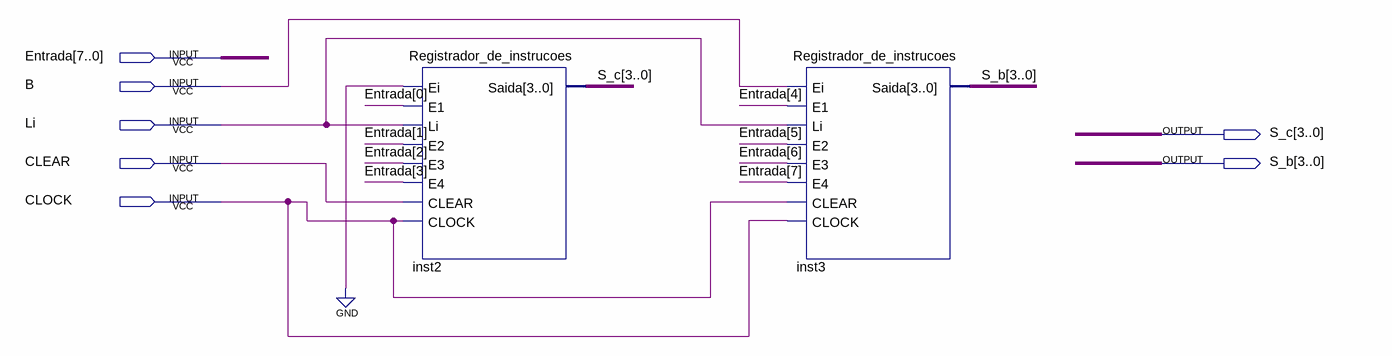
[diagram p0: schematic sheet]
// Quartus schematic Registrador_de_instrucoes_COMPLETO.bdf as structural Verilog: 2 symbols, 7 pins
module Registrador_de_instrucoes_COMPLETO (
  input  [7:0] Entrada,
  input  B,
  input  Li,
  input  CLEAR,
  input  CLOCK,
  output [3:0] S_c,
  output [3:0] S_b
);

  Registrador_de_instrucoes inst2 (
    .Ei(1'b0), .E1(Entrada[0]), .Li(Li), .E2(Entrada[1]), .E3(Entrada[2]), .E4(Entrada[3]), .CLEAR(CLEAR),
    .CLOCK(CLOCK), .Saida(S_c));
  Registrador_de_instrucoes inst3 (
    .Ei(B), .E1(Entrada[4]), .Li(Li), .E2(Entrada[5]), .E3(Entrada[6]), .E4(Entrada[7]), .CLEAR(CLOCK),
    .CLOCK(CLOCK), .Saida(S_b));
endmodule
